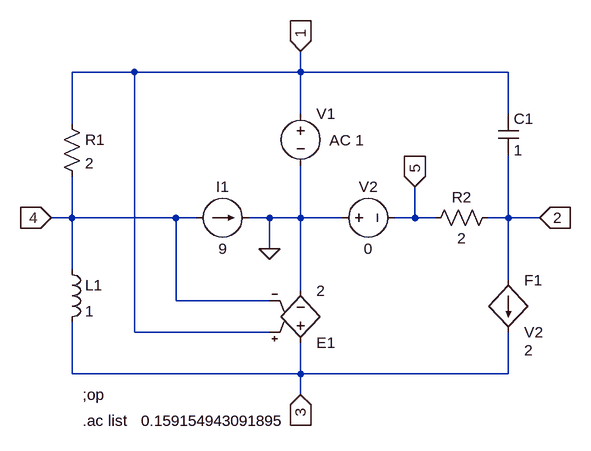
[diagram p0: schematic test_3.asc]
test_3.asc, the LTspice schematic file:
Version 4
SHEET 1 880 680
WIRE 32 -48 -64 -48
WIRE 288 -48 288 -80
WIRE 288 -48 32 -48
WIRE 608 -48 288 -48
WIRE 288 16 288 -48
WIRE 608 16 608 -48
WIRE -64 32 -64 -48
WIRE -64 176 -64 112
WIRE -64 176 -96 176
WIRE 96 176 -64 176
WIRE 128 176 96 176
WIRE 240 176 208 176
WIRE 288 176 288 96
WIRE 288 176 240 176
WIRE 352 176 288 176
WIRE 464 176 464 128
WIRE 464 176 432 176
WIRE 496 176 464 176
WIRE 608 176 608 80
WIRE 608 176 576 176
WIRE 656 176 608 176
WIRE 240 224 240 176
WIRE -64 256 -64 176
WIRE 608 272 608 176
WIRE 288 288 288 176
WIRE 96 304 96 176
WIRE 240 304 96 304
WIRE 32 352 32 -48
WIRE 240 352 32 352
WIRE -64 416 -64 336
WIRE 288 416 288 368
WIRE 288 416 -64 416
WIRE 608 416 608 352
WIRE 608 416 288 416
WIRE 288 448 288 416
FLAG 240 224 0
FLAG -96 176 4
IOPIN -96 176 In
FLAG 288 -80 1
IOPIN 288 -80 In
FLAG 656 176 2
IOPIN 656 176 In
FLAG 288 448 3
IOPIN 288 448 In
FLAG 464 128 5
IOPIN 464 128 In
SYMBOL res 592 160 R90
WINDOW 0 0 56 VBottom 2
WINDOW 3 32 56 VTop 2
SYMATTR InstName R2
SYMATTR Value 2
SYMBOL voltage 288 0 R0
WINDOW 123 44 57 Left 2
WINDOW 39 0 0 Left 2
WINDOW 3 24 96 Invisible 2
SYMATTR Value2 AC 1
SYMATTR Value 0
SYMATTR InstName V1
SYMBOL current 128 176 R270
WINDOW 0 32 40 VTop 2
WINDOW 3 -32 40 VBottom 2
WINDOW 123 0 0 Left 2
WINDOW 39 0 0 Left 2
SYMATTR InstName I1
SYMATTR Value 9
SYMBOL voltage 336 176 R270
WINDOW 0 32 56 VTop 2
WINDOW 3 -32 56 VBottom 2
WINDOW 123 0 0 Left 2
WINDOW 39 0 0 Left 2
SYMATTR InstName V2
SYMATTR Value 0
SYMBOL e 288 384 M180
SYMATTR InstName E1
SYMATTR Value 2
SYMBOL f 608 272 R0
WINDOW 123 24 108 Left 2
SYMATTR Value2 2
SYMATTR InstName F1
SYMATTR Value V2
SYMBOL res -80 16 R0
SYMATTR InstName R1
SYMATTR Value 2
SYMBOL cap 592 16 R0
SYMATTR InstName C1
SYMATTR Value 1
SYMBOL ind -80 240 R0
SYMATTR InstName L1
SYMATTR Value 1
SYMATTR SpiceLine Rser=0
TEXT -48 448 Left 2 !;op
TEXT -48 488 Left 2 !.ac list   0.159154943091895

The netlist it stands for:
* test_3.asc
R2 2 5 2
V1 1 0 0 AC 1
I1 4 0 9
V2 0 5 0
E1 3 0 1 4 2
F1 2 3 V2 2
R1 1 4 2
C1 1 2 1
L1 4 3 1 Rser=0
;op
.ac list   0.159154943091895
.backanno
.end